# Altium schematic sheet LED_Matrix_MCI_Vorlage.SchDoc
size A3; SheetNumber: 1; SheetTotal: 1
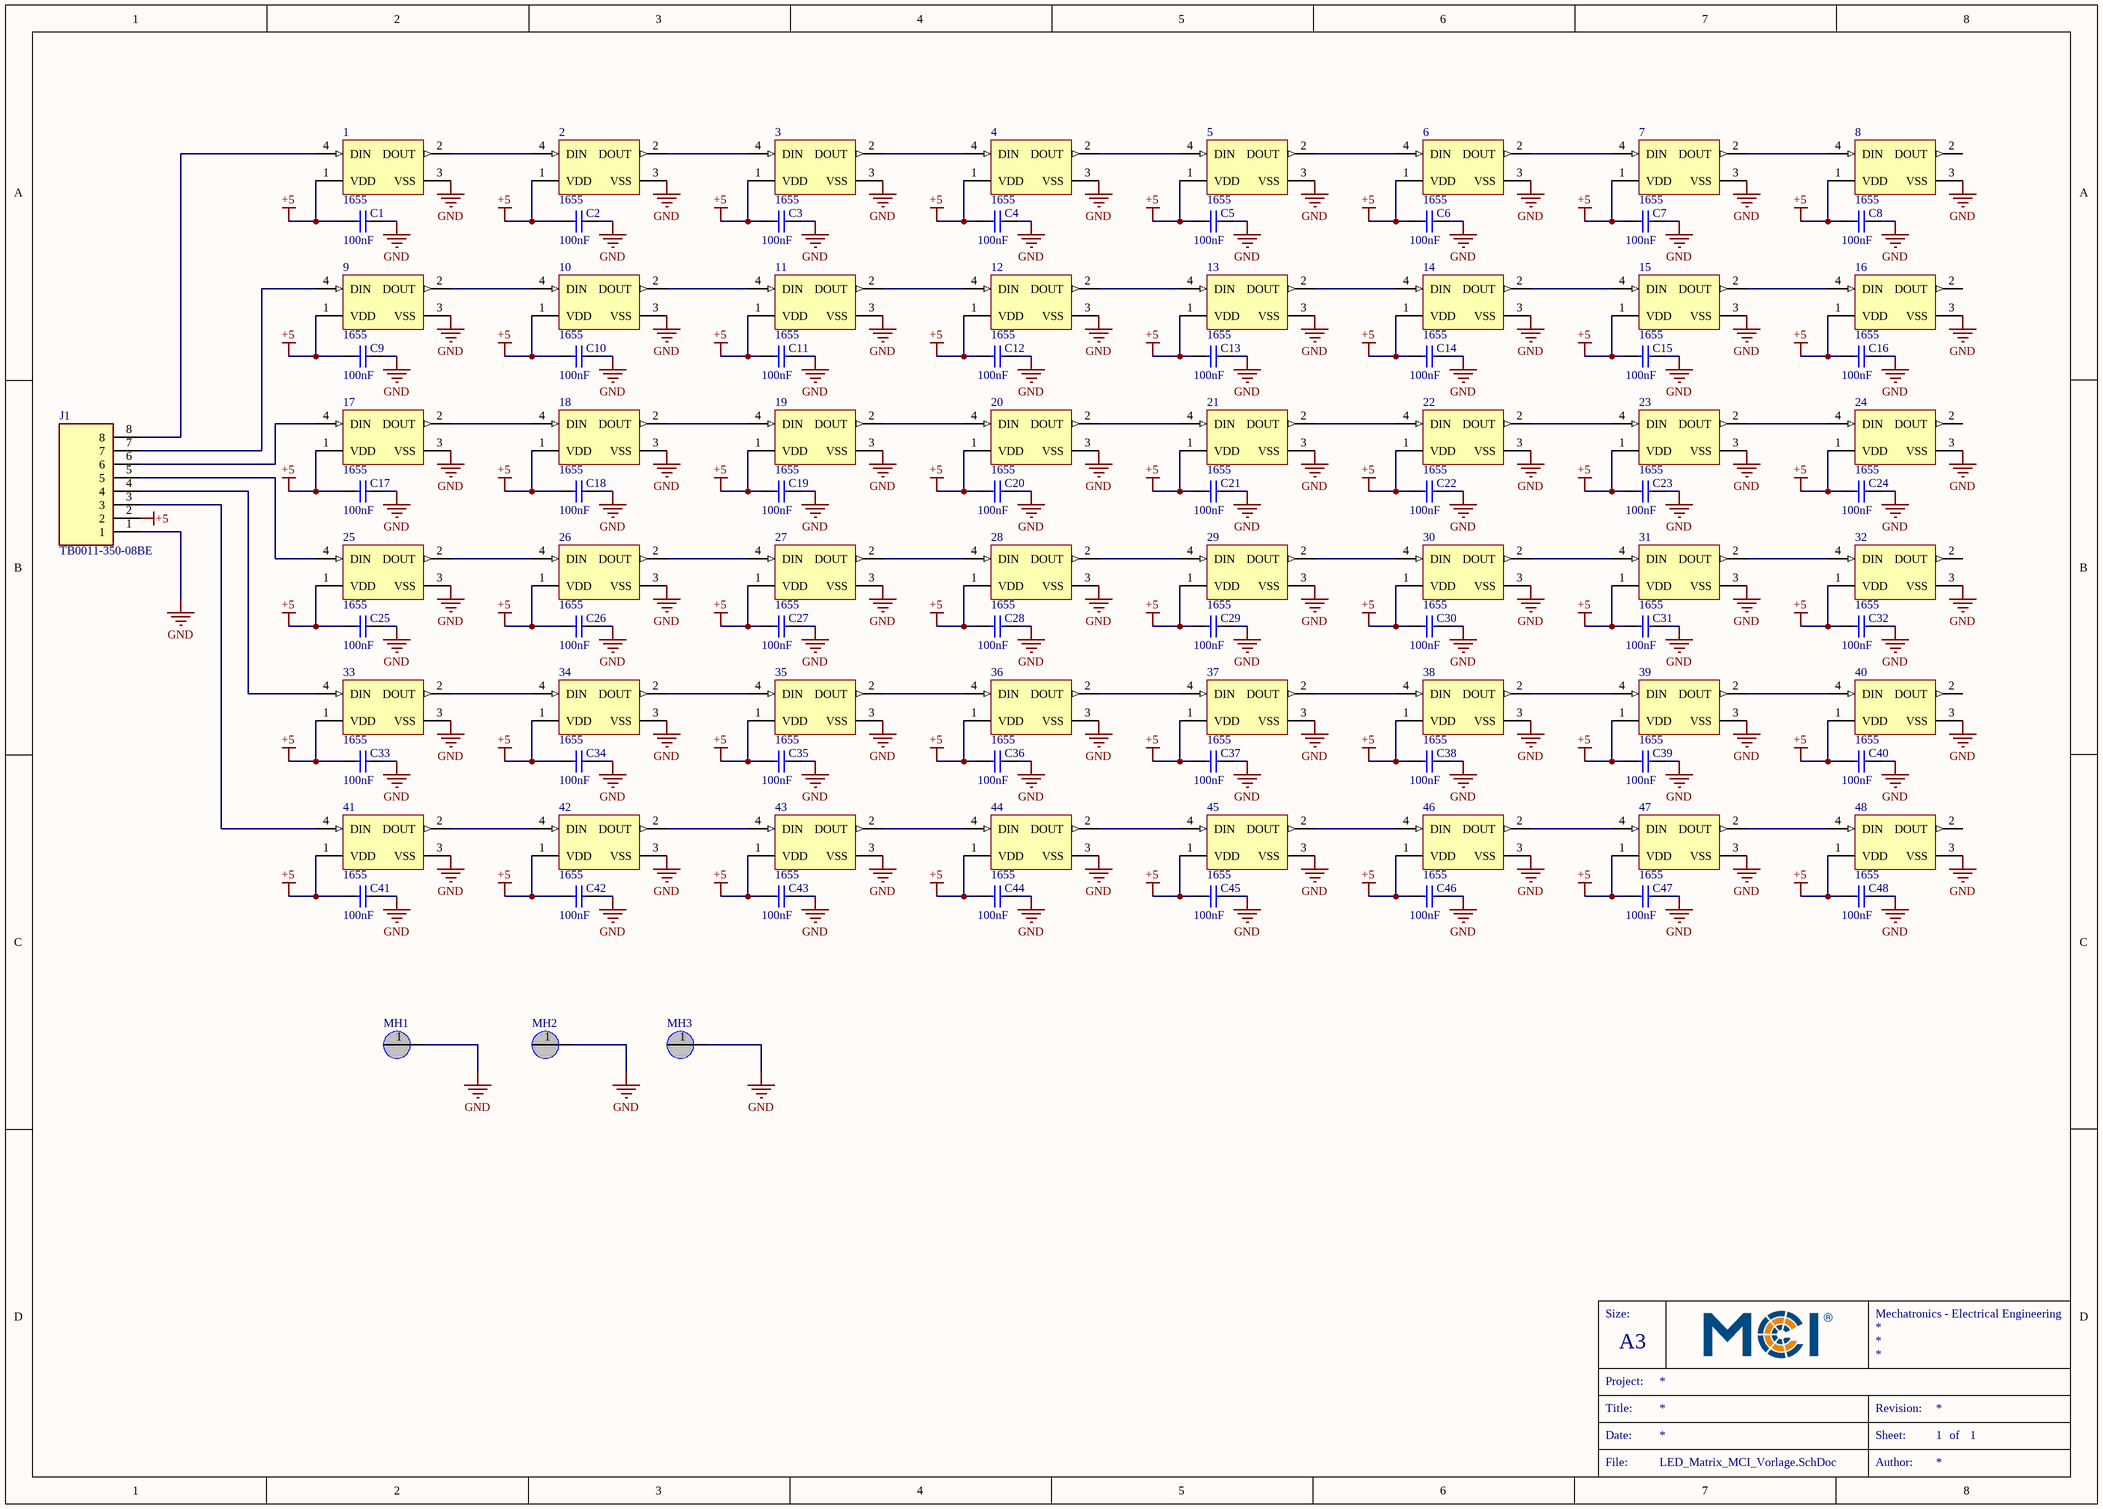
[diagram p0: LED_Matrix_MCI_Vorlage.SchDoc]

## Parts
1  1655  [ADA-RGB-1655_V]
2  1655  [ADA-RGB-1655_V]
3  1655  [ADA-RGB-1655_V]
4  1655  [ADA-RGB-1655_V]
5  1655  [ADA-RGB-1655_V]
6  1655  [ADA-RGB-1655_V]
7  1655  [ADA-RGB-1655_V]
8  1655  [ADA-RGB-1655_V]
9  1655  [ADA-RGB-1655_V]
10  1655  [ADA-RGB-1655_V]
11  1655  [ADA-RGB-1655_V]
12  1655  [ADA-RGB-1655_V]
13  1655  [ADA-RGB-1655_V]
14  1655  [ADA-RGB-1655_V]
15  1655  [ADA-RGB-1655_V]
16  1655  [ADA-RGB-1655_V]
17  1655  [ADA-RGB-1655_V]
18  1655  [ADA-RGB-1655_V]
19  1655  [ADA-RGB-1655_V]
20  1655  [ADA-RGB-1655_V]
21  1655  [ADA-RGB-1655_V]
22  1655  [ADA-RGB-1655_V]
23  1655  [ADA-RGB-1655_V]
24  1655  [ADA-RGB-1655_V]
25  1655  [ADA-RGB-1655_V]
26  1655  [ADA-RGB-1655_V]
27  1655  [ADA-RGB-1655_V]
28  1655  [ADA-RGB-1655_V]
29  1655  [ADA-RGB-1655_V]
30  1655  [ADA-RGB-1655_V]
31  1655  [ADA-RGB-1655_V]
32  1655  [ADA-RGB-1655_V]
33  1655  [ADA-RGB-1655_V]
34  1655  [ADA-RGB-1655_V]
35  1655  [ADA-RGB-1655_V]
36  1655  [ADA-RGB-1655_V]
37  1655  [ADA-RGB-1655_V]
38  1655  [ADA-RGB-1655_V]
39  1655  [ADA-RGB-1655_V]
40  1655  [ADA-RGB-1655_V]
41  1655  [ADA-RGB-1655_V]
42  1655  [ADA-RGB-1655_V]
43  1655  [ADA-RGB-1655_V]
44  1655  [ADA-RGB-1655_V]
45  1655  [ADA-RGB-1655_V]
46  1655  [ADA-RGB-1655_V]
47  1655  [ADA-RGB-1655_V]
48  1655  [ADA-RGB-1655_V]
C1  100nF  [CAPC0805(2012)100_M]
C2  100nF  [CAPC0805(2012)100_M]
C3  100nF  [CAPC0805(2012)100_M]
C4  100nF  [CAPC0805(2012)100_M]
C5  100nF  [CAPC0805(2012)100_M]
C6  100nF  [CAPC0805(2012)100_M]
C7  100nF  [CAPC0805(2012)100_M]
C8  100nF  [CAPC0805(2012)100_M]
C9  100nF  [CAPC0805(2012)100_M]
C10  100nF  [CAPC0805(2012)100_M]
C11  100nF  [CAPC0805(2012)100_M]
C12  100nF  [CAPC0805(2012)100_M]
C13  100nF  [CAPC0805(2012)100_M]
C14  100nF  [CAPC0805(2012)100_M]
C15  100nF  [CAPC0805(2012)100_M]
C16  100nF  [CAPC0805(2012)100_M]
C17  100nF  [CAPC0805(2012)100_M]
C18  100nF  [CAPC0805(2012)100_M]
C19  100nF  [CAPC0805(2012)100_M]
C20  100nF  [CAPC0805(2012)100_M]
C21  100nF  [CAPC0805(2012)100_M]
C22  100nF  [CAPC0805(2012)100_M]
C23  100nF  [CAPC0805(2012)100_M]
C24  100nF  [CAPC0805(2012)100_M]
C25  100nF  [CAPC0805(2012)100_M]
C26  100nF  [CAPC0805(2012)100_M]
C27  100nF  [CAPC0805(2012)100_M]
C28  100nF  [CAPC0805(2012)100_M]
C29  100nF  [CAPC0805(2012)100_M]
C30  100nF  [CAPC0805(2012)100_M]
C31  100nF  [CAPC0805(2012)100_M]
C32  100nF  [CAPC0805(2012)100_M]
C33  100nF  [CAPC0805(2012)100_M]
C34  100nF  [CAPC0805(2012)100_M]
C35  100nF  [CAPC0805(2012)100_M]
C36  100nF  [CAPC0805(2012)100_M]
C37  100nF  [CAPC0805(2012)100_M]
C38  100nF  [CAPC0805(2012)100_M]
C39  100nF  [CAPC0805(2012)100_M]
C40  100nF  [CAPC0805(2012)100_M]
C41  100nF  [CAPC0805(2012)100_M]
C42  100nF  [CAPC0805(2012)100_M]
C43  100nF  [CAPC0805(2012)100_M]
C44  100nF  [CAPC0805(2012)100_M]
C45  100nF  [CAPC0805(2012)100_M]
C46  100nF  [CAPC0805(2012)100_M]
C47  100nF  [CAPC0805(2012)100_M]
C48  100nF  [CAPC0805(2012)100_M]
J1  TB0011-350-08BE  [TB0011-350-08BE]
MH1  MountingHole  [MTH]  (value not drawn)
MH2  MountingHole  [MTH]  (value not drawn)
MH3  MountingHole  [MTH]  (value not drawn)

## Nets
+5: 1.1(VDD) 2.1(VDD) 3.1(VDD) 4.1(VDD) 5.1(VDD) 6.1(VDD) 7.1(VDD) 8.1(VDD) 9.1(VDD) 10.1(VDD) 11.1(VDD) 12.1(VDD) 13.1(VDD) 14.1(VDD) 15.1(VDD) 16.1(VDD) 17.1(VDD) 18.1(VDD) 19.1(VDD) 20.1(VDD) 21.1(VDD) 22.1(VDD) 23.1(VDD) 24.1(VDD) 25.1(VDD) 26.1(VDD) 27.1(VDD) 28.1(VDD) 29.1(VDD) 30.1(VDD) 31.1(VDD) 32.1(VDD) 33.1(VDD) 34.1(VDD) 35.1(VDD) 36.1(VDD) 37.1(VDD) 38.1(VDD) 39.1(VDD) 40.1(VDD) 41.1(VDD) 42.1(VDD) 43.1(VDD) 44.1(VDD) 45.1(VDD) 46.1(VDD) 47.1(VDD) 48.1(VDD) C1.1 C2.1 C3.1 C4.1 C5.1 C6.1 C7.1 C8.1 C9.1 C10.1 C11.1 C12.1 C13.1 C14.1 C15.1 C16.1 C17.1 C18.1 C19.1 C20.1 C21.1 C22.1 C23.1 C24.1 C25.1 C26.1 C27.1 C28.1 C29.1 C30.1 C31.1 C32.1 C33.1 C34.1 C35.1 C36.1 C37.1 C38.1 C39.1 C40.1 C41.1 C42.1 C43.1 C44.1 C45.1 C46.1 C47.1 C48.1 J1.2
GND: 1.3(VSS) 2.3(VSS) 3.3(VSS) 4.3(VSS) 5.3(VSS) 6.3(VSS) 7.3(VSS) 8.3(VSS) 9.3(VSS) 10.3(VSS) 11.3(VSS) 12.3(VSS) 13.3(VSS) 14.3(VSS) 15.3(VSS) 16.3(VSS) 17.3(VSS) 18.3(VSS) 19.3(VSS) 20.3(VSS) 21.3(VSS) 22.3(VSS) 23.3(VSS) 24.3(VSS) 25.3(VSS) 26.3(VSS) 27.3(VSS) 28.3(VSS) 29.3(VSS) 30.3(VSS) 31.3(VSS) 32.3(VSS) 33.3(VSS) 34.3(VSS) 35.3(VSS) 36.3(VSS) 37.3(VSS) 38.3(VSS) 39.3(VSS) 40.3(VSS) 41.3(VSS) 42.3(VSS) 43.3(VSS) 44.3(VSS) 45.3(VSS) 46.3(VSS) 47.3(VSS) 48.3(VSS) C1.2 C2.2 C3.2 C4.2 C5.2 C6.2 C7.2 C8.2 C9.2 C10.2 C11.2 C12.2 C13.2 C14.2 C15.2 C16.2 C17.2 C18.2 C19.2 C20.2 C21.2 C22.2 C23.2 C24.2 C25.2 C26.2 C27.2 C28.2 C29.2 C30.2 C31.2 C32.2 C33.2 C34.2 C35.2 C36.2 C37.2 C38.2 C39.2 C40.2 C41.2 C42.2 C43.2 C44.2 C45.2 C46.2 C47.2 C48.2 J1.1 MH1.1 MH2.1 MH3.1
Net1_2: 1.2(DOUT) 2.4(DIN)
Net1_4: 1.4(DIN) J1.8
Net2_2: 2.2(DOUT) 3.4(DIN)
Net3_2: 3.2(DOUT) 4.4(DIN)
Net4_2: 4.2(DOUT) 5.4(DIN)
Net5_2: 5.2(DOUT) 6.4(DIN)
Net6_2: 6.2(DOUT) 7.4(DIN)
Net7_2: 7.2(DOUT) 8.4(DIN)
Net9_2: 9.2(DOUT) 10.4(DIN)
Net9_4: 9.4(DIN) J1.7
Net10_2: 10.2(DOUT) 11.4(DIN)
Net11_2: 11.2(DOUT) 12.4(DIN)
Net12_2: 12.2(DOUT) 13.4(DIN)
Net13_2: 13.2(DOUT) 14.4(DIN)
Net14_2: 14.2(DOUT) 15.4(DIN)
Net15_2: 15.2(DOUT) 16.4(DIN)
Net17_2: 17.2(DOUT) 18.4(DIN)
Net17_4: 17.4(DIN) J1.6
Net18_2: 18.2(DOUT) 19.4(DIN)
Net19_2: 19.2(DOUT) 20.4(DIN)
Net20_2: 20.2(DOUT) 21.4(DIN)
Net21_2: 21.2(DOUT) 22.4(DIN)
Net22_2: 22.2(DOUT) 23.4(DIN)
Net23_2: 23.2(DOUT) 24.4(DIN)
Net25_2: 25.2(DOUT) 26.4(DIN)
Net25_4: 25.4(DIN) J1.5
Net26_2: 26.2(DOUT) 27.4(DIN)
Net27_2: 27.2(DOUT) 28.4(DIN)
Net28_2: 28.2(DOUT) 29.4(DIN)
Net29_2: 29.2(DOUT) 30.4(DIN)
Net30_2: 30.2(DOUT) 31.4(DIN)
Net31_2: 31.2(DOUT) 32.4(DIN)
Net33_2: 33.2(DOUT) 34.4(DIN)
Net33_4: 33.4(DIN) J1.4
Net34_2: 34.2(DOUT) 35.4(DIN)
Net35_2: 35.2(DOUT) 36.4(DIN)
Net36_2: 36.2(DOUT) 37.4(DIN)
Net37_2: 37.2(DOUT) 38.4(DIN)
Net38_2: 38.2(DOUT) 39.4(DIN)
Net39_2: 39.2(DOUT) 40.4(DIN)
Net41_2: 41.2(DOUT) 42.4(DIN)
Net41_4: 41.4(DIN) J1.3
Net42_2: 42.2(DOUT) 43.4(DIN)
Net43_2: 43.2(DOUT) 44.4(DIN)
Net44_2: 44.2(DOUT) 45.4(DIN)
Net45_2: 45.2(DOUT) 46.4(DIN)
Net46_2: 46.2(DOUT) 47.4(DIN)
Net47_2: 47.2(DOUT) 48.4(DIN)

Not connected (* = marked no-connect by the designer): 8 2(DOUT); 16 2(DOUT); 24 2(DOUT); 32 2(DOUT); 40 2(DOUT); 48 2(DOUT)

## Notes on the sheet
- Size:
- Mechatronics - Electrical Engineering
- Project:
- A3
- Title:
- Date:
- Revision:
- Sheet:
- of
- File:
- Author:

## Library data of the parts
1-48 = CMP-2000-05026-1: Intelligent Control LED Integrated Light Source, 3.5 to 5.3 V, -25 to 80 degC, 4-Pin SMD, RoHS, Tape and Reel; Manufacturer: Adafruit-Industries-LLC; Number of LEDs: 10; Configuration: Discrete; Utilized LED: WS2812(5050); Datasheet URL: http://datasheet.octopart.com/ADA1655-Adafruit-Industries-datasheet-32028139.pdf; Series: Neopixel; Interface: -; Package Description: 4-Pin Surface Mount Device, Body 5 x 5 mm; Color: Red,Green,Blue(RGB); Category: Optoelectronics; Controller Type: -; Package Reference: 1655; Manufacturer URL: https://www.adafruit.com/; Mounting Type: SurfaceMount; Datasheet Version: May-13; Size / Dimension: 5.00mmLx5.00mmW; Family: Addressable,Specialty
C1-C48 = CMP-1036-04393-1: CAP 100nF 10V ±5% 0805 (2012 Metric) Thickness 1mm SMD; Tolerance: Â±5%; Case-EIA: 0805; Case-Metric: 2012; Rated Voltage: 10 V; Technology: SMT; Value: 100nF; Max Thickness: 1 mm
J1 = TB0011-350-08BE: Connector; Manufacturer_Name: Same Sky; Datasheet Link: https://www.sameskydevices.com/product/resource/tb0011-350.pdf; Height: 8.5mm; Manufacturer_Part_Number: TB0011-350-08BE